# Altium schematic sheet [2] BlockDiagram.SchDoc
size A3; DocumentNumber: 2; SheetNumber: 2; SheetTotal: 9
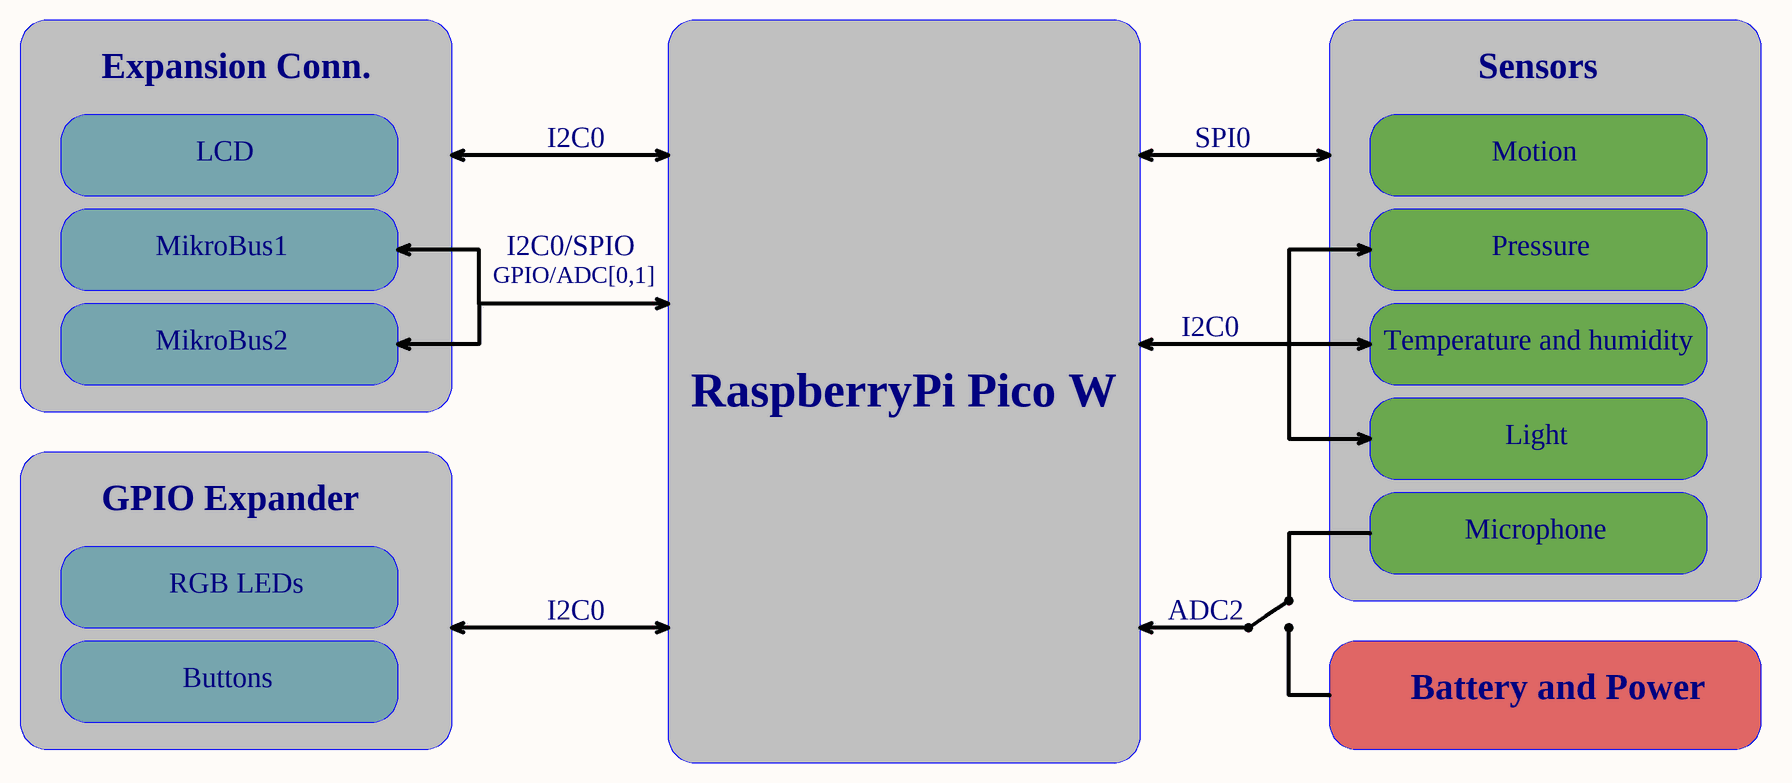
[diagram p0: [2] BlockDiagram.SchDoc]

## Notes on the sheet
- Expansion Conn.
- Sensors
- I2C0
- SPI0
- LCD
- Motion
- MikroBus1
- GPIO/ADC[0,1]
- I2C0/SPIO
- Pressure
- MikroBus2
- Temperature and humidity
- RaspberryPi Pico W
- Light
- GPIO Expander
- Microphone
- RGB LEDs
- ADC2
- Buttons
- Battery and Power
- REVISION
- DESCRIPTION
- DATE
- APPROVED
- ADDRESS
- PROJECT
- VERSION
- TITLE
- A3
- SIZE
- SCALE
- DOCUMENT NAME:
- DOCUMENT REVISION:
- OF
- SHEET:
- PROJECT REVISION: